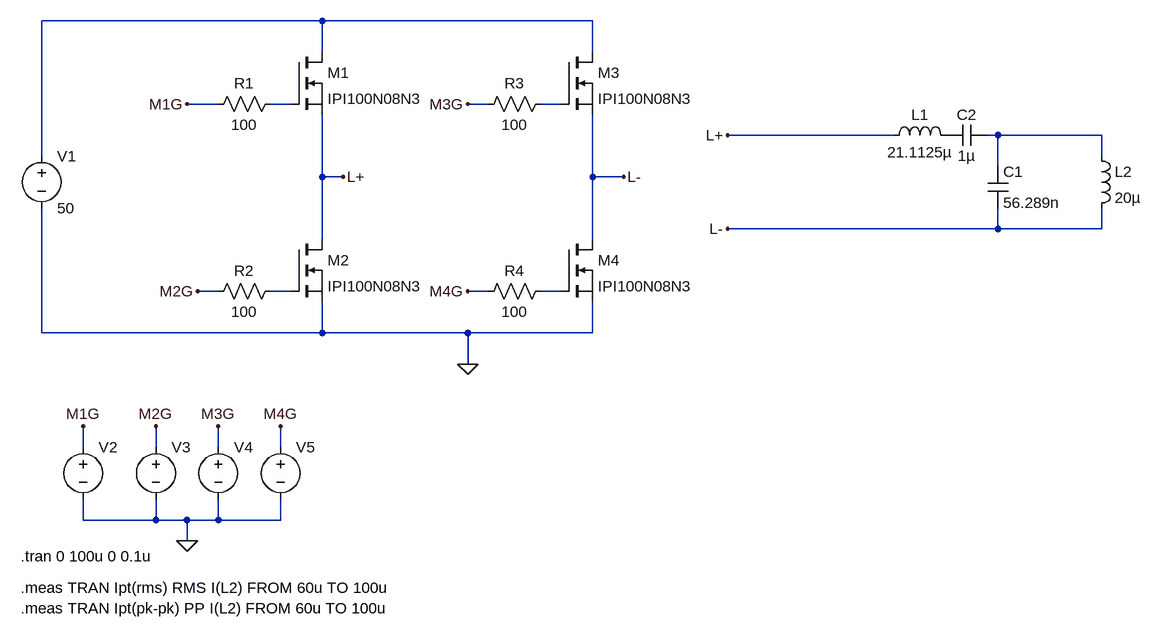
[diagram p0: schematic Inverter&tuning sim.asc]
Inverter&tuning sim.asc, the LTspice schematic file:
Version 4
SHEET 1 1444 920
WIRE 176 0 -256 0
WIRE 592 0 176 0
WIRE 176 48 176 0
WIRE 592 48 592 0
WIRE 16 128 -32 128
WIRE 128 128 96 128
WIRE 432 128 400 128
WIRE 544 128 512 128
WIRE 1056 176 800 176
WIRE 1216 176 1200 176
WIRE 1376 176 1216 176
WIRE -256 208 -256 0
WIRE 1376 208 1376 176
WIRE 1216 224 1216 176
WIRE 176 240 176 144
WIRE 208 240 176 240
WIRE 592 240 592 144
WIRE 640 240 592 240
WIRE 1216 320 1216 288
WIRE 1216 320 800 320
WIRE 1376 320 1376 288
WIRE 1376 320 1216 320
WIRE 176 336 176 240
WIRE 592 336 592 240
WIRE 16 416 -16 416
WIRE 128 416 96 416
WIRE 432 416 400 416
WIRE 544 416 512 416
WIRE -256 480 -256 288
WIRE 176 480 176 432
WIRE 176 480 -256 480
WIRE 400 480 176 480
WIRE 592 480 592 432
WIRE 592 480 400 480
WIRE 400 528 400 480
WIRE -192 656 -192 624
WIRE -80 656 -80 624
WIRE 16 656 16 624
WIRE 112 656 112 624
WIRE -192 768 -192 736
WIRE -80 768 -80 736
WIRE -80 768 -192 768
WIRE -32 768 -80 768
WIRE 16 768 16 736
WIRE 16 768 -32 768
WIRE 112 768 112 736
WIRE 112 768 16 768
WIRE -32 800 -32 768
FLAG -192 624 M1G
FLAG -32 128 M1G
FLAG -80 624 M2G
FLAG -16 416 M2G
FLAG 16 624 M3G
FLAG 400 128 M3G
FLAG 112 624 M4G
FLAG 400 416 M4G
FLAG -32 800 0
FLAG 208 240 L+
FLAG 640 240 L-
FLAG 800 176 L+
FLAG 800 320 L-
FLAG 400 528 0
SYMBOL nmos 128 48 R0
SYMATTR InstName M1
SYMATTR Value IPI100N08N3
SYMBOL nmos 128 336 R0
SYMATTR InstName M2
SYMATTR Value IPI100N08N3
SYMBOL nmos 544 48 R0
SYMATTR InstName M3
SYMATTR Value IPI100N08N3
SYMBOL nmos 544 336 R0
SYMATTR InstName M4
SYMATTR Value IPI100N08N3
SYMBOL voltage -256 192 R0
WINDOW 123 0 0 Left 0
WINDOW 39 0 0 Left 0
SYMATTR InstName V1
SYMATTR Value 50
SYMBOL voltage -192 640 R0
WINDOW 3 24 96 Invisible 2
WINDOW 123 0 0 Left 0
WINDOW 39 0 0 Left 0
SYMATTR Value PULSE(0 62 0 1f 1f 2.93333u 6.66667u)
SYMATTR InstName V2
SYMBOL voltage -80 640 R0
WINDOW 3 24 96 Invisible 2
WINDOW 123 0 0 Left 0
WINDOW 39 0 0 Left 0
SYMATTR Value PULSE(0 12 3.33333u 1f 1f 2.93333u 6.66667u)
SYMATTR InstName V3
SYMBOL voltage 112 640 R0
WINDOW 3 24 96 Invisible 2
WINDOW 123 0 0 Left 0
WINDOW 39 0 0 Left 0
SYMATTR Value PULSE(0 12 0 1f 1f 2.93333u 6.66667u)
SYMATTR InstName V5
SYMBOL res 112 112 R90
WINDOW 0 0 56 VBottom 2
WINDOW 3 32 56 VTop 2
SYMATTR InstName R1
SYMATTR Value 100
SYMBOL res 112 400 R90
WINDOW 0 0 56 VBottom 2
WINDOW 3 32 56 VTop 2
SYMATTR InstName R2
SYMATTR Value 100
SYMBOL res 528 112 R90
WINDOW 0 0 56 VBottom 2
WINDOW 3 32 56 VTop 2
SYMATTR InstName R3
SYMATTR Value 100
SYMBOL res 528 400 R90
WINDOW 0 0 56 VBottom 2
WINDOW 3 32 56 VTop 2
SYMATTR InstName R4
SYMATTR Value 100
SYMBOL voltage 16 640 R0
WINDOW 3 24 96 Invisible 2
WINDOW 123 0 0 Left 0
WINDOW 39 0 0 Left 0
SYMATTR Value PULSE(0 62 3.33333u 1f 1f 2.93333u 6.66667u)
SYMATTR InstName V4
SYMBOL ind 1040 192 R270
WINDOW 0 32 56 VTop 2
WINDOW 3 5 56 VBottom 2
SYMATTR InstName L1
SYMATTR Value 21.1125µ
SYMBOL cap 1200 224 R0
SYMATTR InstName C1
SYMATTR Value 56.289n
SYMBOL ind 1360 192 R0
SYMATTR InstName L2
SYMATTR Value 20µ
SYMBOL cap 1200 160 R90
WINDOW 0 0 32 VBottom 2
WINDOW 3 32 32 VTop 2
SYMATTR InstName C2
SYMATTR Value 1µ
TEXT -288 824 Left 2 !.tran 0 100u 0 0.1u
TEXT -288 872 Left 2 !.meas TRAN Ipt(rms) RMS I(L2) FROM 60u TO 100u
TEXT -288 904 Left 2 !.meas TRAN Ipt(pk-pk) PP I(L2) FROM 60u TO 100u

The netlist it stands for:
* Inverter&tuning sim.asc
M1 N001 N002 L+ L+ IPI100N08N3
M2 L+ N005 0 0 IPI100N08N3
M3 N001 N003 L- L- IPI100N08N3
M4 L- N006 0 0 IPI100N08N3
V1 N001 0 50
V2 M1G 0 PULSE(0 62 0 1f 1f 2.93333u 6.66667u)
V3 M2G 0 PULSE(0 12 3.33333u 1f 1f 2.93333u 6.66667u)
V5 M4G 0 PULSE(0 12 0 1f 1f 2.93333u 6.66667u)
R1 N002 M1G 100
R2 N005 M2G 100
R3 N003 M3G 100
R4 N006 M4G 100
V4 M3G 0 PULSE(0 62 3.33333u 1f 1f 2.93333u 6.66667u)
L1 L+ P001 21.1125µ
C1 N004 L- 56.289n
L2 N004 L- 20µ
C2 N004 P001 1µ
.model NMOS NMOS
.model PMOS PMOS
.lib standard.mos
.tran 0 100u 0 0.1u
.meas TRAN Ipt(rms) RMS I(L2) FROM 60u TO 100u
.meas TRAN Ipt(pk-pk) PP I(L2) FROM 60u TO 100u
.backanno
.end